# Altium project Pikachu_Charger.PrjPcb
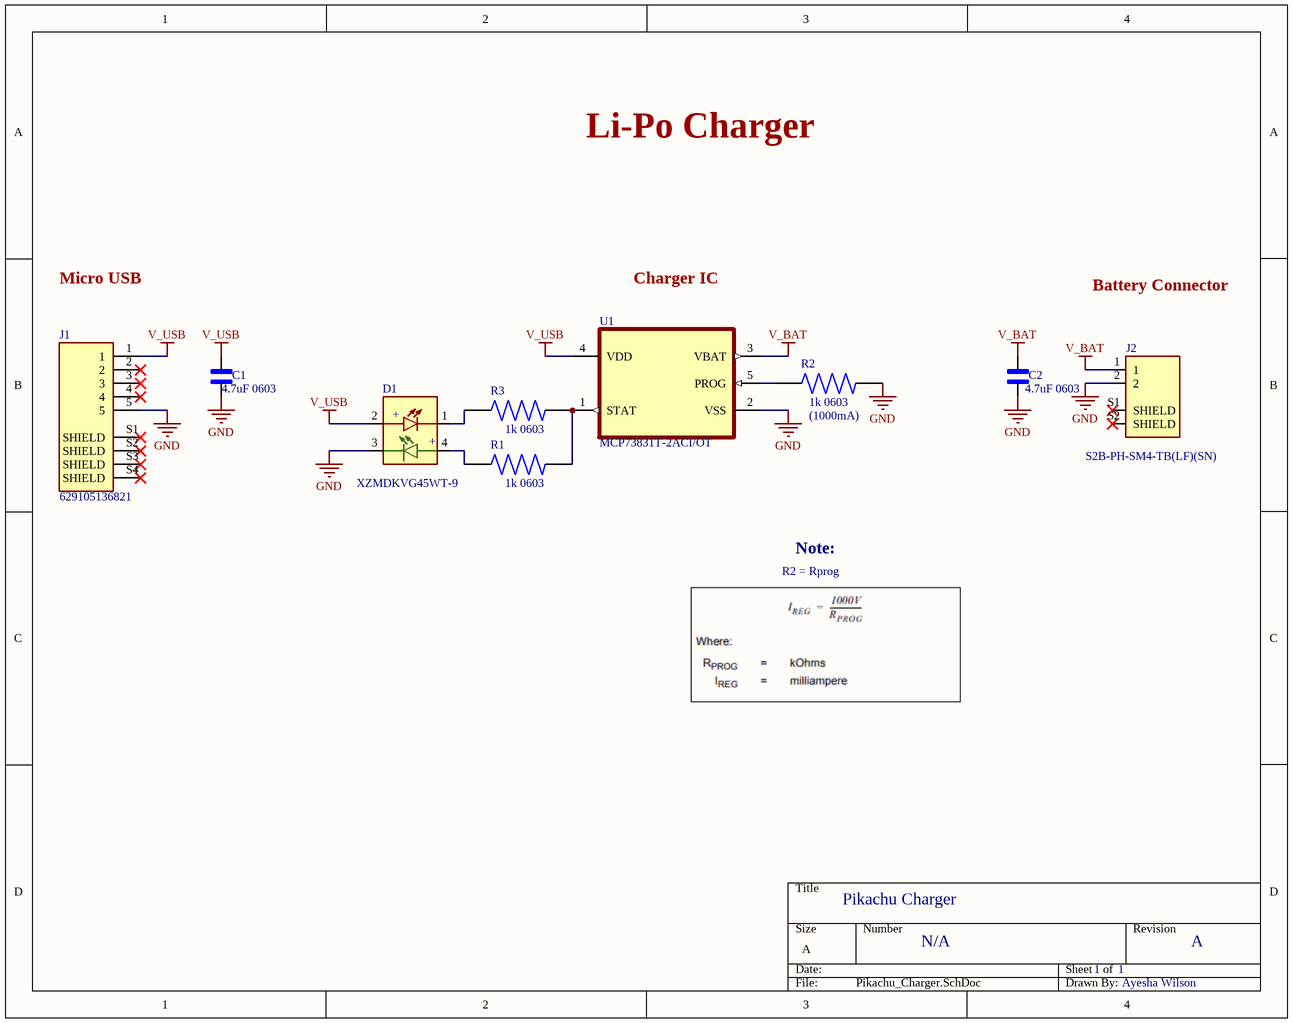
[diagram p0: Pikachu_Charger.SchDoc]
1 sheet, 9 parts. Net scope: global (net labels, ports and power ports of the same name join across sheets).
Board file: Pikachu_Charger.PcbDoc

## Sheet Pikachu_Charger.SchDoc
size A; SheetNumber: 1; SheetTotal: 1

### Parts
C1  value 4.7uF 0603  [CAPC1608X100N]  (hidden comment: GRT188R61E475KE13D)
C2  value 4.7uF 0603  [CAPC1608X100N]  (hidden comment: GRT188R61E475KE13D)
D1  XZMDKVG45WT-9  [XZMDKVG45WT-9]
J1  629105136821  [WE_629105136821]
J2  S2B-PH-SM4-TB(LF)(SN)  [JST_S2B-PH-SM4-TB(LF)(SN)]
R1  value 1k 0603  [RESC1508X55N]  (hidden comment: MCT0603HC1001FP100)
R2  value 1k 0603  [RESC1508X55N]  (hidden comment: MCT0603HC1001FP100)
R3  value 1k 0603  [RESC1508X55N]  (hidden comment: MCT0603HC1001FP100)
U1  MCP73831T-2ACI/OT  [SOT95P280X145-5N]

### Nets
GND: C1.1 C2.1 D1.3(V-) J1.5 J2.2 R2.2 U1.2(VSS)
V_BAT: C2.2 J2.1 U1.3(VBAT)
V_USB: C1.2 D1.2(S+) J1.1 U1.4(VDD)
NetD1_1: D1.1(S-) R3.1
NetD1_4: D1.4(V+) R1.1
NetR1_2: R1.2 R3.2 U1.1(STAT)
NetR2_1: R2.1 U1.5(PROG)

Not connected (* = marked no-connect by the designer): J1 2* 3* 4* S1(SHIELD)* S2(SHIELD)* S3(SHIELD)* S4(SHIELD)*; J2 S1(SHIELD)* S2(SHIELD)*

### Notes on the sheet
- Li-Po Charger
- Micro USB
- Charger IC
- Battery Connector
- (near R2) (1000mA)
- Note:
- R2 = Rprog
- Pikachu Charger
- N/A
- 1
- A
- Ayesha Wilson
- (in symbol XZMDKVG45WT-9) +

### Library data of the parts
C1 C2 = GRM188R61E106KA73J: SMD Capacitor X5R(EIA) with Capacitance: 4.7uF Tol. 10%. Rated Voltage: 25Vdc; MF: Murata Electronics; Package: None; Price: None; MP: GRT188R61E475KE13D; Availability: Unavailable
D1 = XZMDKVG45WT-9: Value: Rev Mounted Red-Green LED; MF: SunLED; MP: XZMDKVG45WT-9
J1 = 629105136821: USB - micro B USB 2.0 Receptacle Connector 5 Position Surface Mount, Right Angle; MF: Wurth Electronics; Value: Micro-USB Receptacle; Package: None; Price: None; SnapEDA_Link: https://www.snapeda.com/parts/629105136821/Wurth%20Electronics%20Inc./view-part/1118247/?ref=snap; Availability: Unavailable; MP: 629105136821
J2 = S2B-PH-SM4-TB(LF)(SN): Connector Header Surface Mount, Right Angle 2 position 0.079 (2.00mm); MF: JST Sales; Value: *; SnapEDA_Link: https://www.snapeda.com/parts/S2B-PH-SM4-TB(LF)(SN)/JST+Sales+America+Inc./view-part/?ref=snap; Purchase-URL: https://pricing.snapeda.com/search/part/S2B-PH-SM4-TB(LF)(SN)/?ref=eda; Check_prices: https://www.snapeda.com/parts/S2B-PH-SM4-TB(LF)(SN)/JST+Sales+America+Inc./view-part/?ref=eda; Digi-Key_Part_Number: 455-1749-2-ND; Package: None; MP: S2B-PH-SM4-TB(LF)(SN)
R1-R3 = MCT0603HC1001FP100: MF: Vishay; Package: None; Price: None; MP: MCT0603HC1001FP100; Availability: Unavailable
U1 = MCP73831T-2ACI/OT: Charger IC Lithium Ion/Polymer SOT-23-5; MF: Microchip; Package: SOT-23 Microchip; MP: MCP73831T-2ACI/OT; Value: *; Availability: In Stock; Price: None